# Altium schematic sheet Differential Channel Protection.SchDoc
size A4; SheetNumber: 7; SheetTotal: 11; TitleBlk1Sch: PCBA, LUCHADOR, REV 3.2b, AMBER; Eng: Haman; EngDate: 3-15-19; RevSch: 01; TitleBlk2Sch: Differential Channel Protection
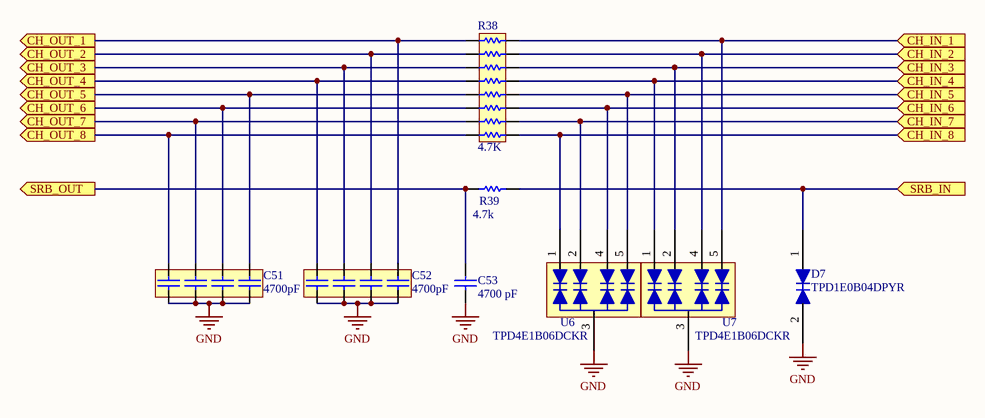
[diagram p0: Differential Channel Protection.SchDoc]

## Parts
C51  Capacitance: 4700pF  [1206C-ARRAY]  (hidden comment: 50V)
C52  Capacitance: 4700pF  [1206C-ARRAY]  (hidden comment: 50V)
C53  Capacitance: 4700 pF  [0402C]  (hidden comment: 50V)
D7  TPD1E0B04DPYR  [0402D]
R38  Resistance: 4.7K  [1506R]  (hidden comment: RES 8X)
R39  Resistance Value: 4.7k  [0402R]  (hidden comment: Res 0805)
U6  TPD4E1B06DCKR  [SC70-6]
U7  TPD4E1B06DCKR  [SC70-6]

## Ports
CH_IN_1 (in), CH_IN_2 (in), CH_IN_3 (in), CH_IN_4 (in), CH_IN_5 (in), CH_IN_6 (in), CH_IN_7 (in), CH_IN_8 (in), CH_OUT_1 (out), CH_OUT_2 (out), CH_OUT_3 (out), CH_OUT_4 (out), CH_OUT_5 (out), CH_OUT_6 (out), CH_OUT_7 (out), CH_OUT_8 (out), SRB_IN (in), SRB_OUT (out)

## Nets
GND: C51.B1 C51.B2 C51.B3 C51.B4 C52.B1 C52.B2 C52.B3 C52.B4 C53.1 D7.2(GND) U6.3(GND) U7.3(GND)
CH_IN_1: R38.B1 U7.5(IO4) ; port CH_IN_1
CH_IN_2: R38.B2 U7.4(IO3) ; port CH_IN_2
CH_IN_3: R38.B3 U7.2(IO2) ; port CH_IN_3
CH_IN_4: R38.B4 U7.1(IO1) ; port CH_IN_4
CH_IN_5: R38.B5 U6.5(IO4) ; port CH_IN_5
CH_IN_6: R38.B6 U6.4(IO3) ; port CH_IN_6
CH_IN_7: R38.B7 U6.2(IO2) ; port CH_IN_7
CH_IN_8: R38.B8 U6.1(IO1) ; port CH_IN_8
CH_OUT_1: C52.A1 R38.A1 ; port CH_OUT_1
CH_OUT_2: C52.A2 R38.A2 ; port CH_OUT_2
CH_OUT_3: C52.A3 R38.A3 ; port CH_OUT_3
CH_OUT_4: C52.A4 R38.A4 ; port CH_OUT_4
CH_OUT_5: C51.A1 R38.A5 ; port CH_OUT_5
CH_OUT_6: C51.A2 R38.A6 ; port CH_OUT_6
CH_OUT_7: C51.A3 R38.A7 ; port CH_OUT_7
CH_OUT_8: C51.A4 R38.A8 ; port CH_OUT_8
SRB_IN: D7.1(IO1) R39.2 ; port SRB_IN
SRB_OUT: C53.2 R39.1 ; port SRB_OUT

## Notes on the sheet
- Title:
- USA
- 100 Mayfield Avenue
- Mountain View, CA 94043
- Variant Name:
- Confidential and Proprietary
- Engineer:
- Date:
- Size:
- A4
- Template:
- 992-00283-00 A
- Dwg No:
- Sheet:
- Rev:
- of

## Library data of the parts
C51 C52 = Cap: CAP .1UF 50V CERAMIC Y5V 0805; Manufacturer: TDK; PCN Part Number: MLCC Part Number Change 30/Nov/2012; Manufacturer Part Number: CKCA43X7R1H472M100AA; Description1: Cap Ceramic Array 0.0047uF 50V X7R 20% 1206 SMD 4 Capacitor 125C Plastic T/R; Product Training Modules: CKC Series Array Capacitor Family; Catalog Drawings: CKC 1206 Series CKC 1206 Series Footprint; Featured Product: CKC Series; Tolerance: ±20%; Number of Capacitors: 4; Circuit Type: Isolated; Temperature Coefficient: X7R; Other Names: 445-1853-1; Revision: July-2002: Re-released for DXP Platform.; Supplier 1: Digi-Key; Supplier Part Number 1: 445-1853-1-ND; Stock 1: 155348; Pricing 1: 1=0.33, 10=0.228, 100=0.129, 500=0.0911, 1000=0.0797 (USD); RoHS Information: RoHS Certificate-MLCC; Standard Package: 1; Category: Capacitors; Family: Capacitor Arrays; Series: CKC; Packaging: Cut Tape (CT); Voltage - Rated: 50V; Dielectric Material: Ceramic; Mounting Type: Surface Mount; Package / Case: 1206 (3216 Metric); Size / Dimension: 0.126" L x 0.063" W (3.20mm x 1.60mm); Height - Seated (Max): 0.051" (1.30mm); Ratings: -; Online Catalog: CKC Series; ComponentLink1URL: https://datasheet.ciiva.com/7615/mlccspec-commercial-array-en-7615142.pdf; ComponentLink1Description: https://datasheet.ciiva.com/7615/mlccspec-commercial-array-en-7615142.pdf; ComponentLink2URL: https://datasheet.ciiva.com/7615/mlccspec-commercial-array-en-7615147.pdf; ComponentLink2Description: https://datasheet.ciiva.com/7615/mlccspec-commercial-array-en-7615147.pdf; ComponentLink3URL: https://datasheet.ciiva.com/7615/mlccspec-commercial-array-en-7615148.pdf; ComponentLink3Description: https://datasheet.ciiva.com/7615/mlccspec-commercial-array-en-7615148.pdf; ComponentLink4URL: https://datasheet.ciiva.com/24216/ckca43x7r1h472m100aa-266209-24216735.pdf; ComponentLink4Description: https://datasheet.ciiva.com/24216/ckca43x7r1h472m100aa-266209-24216735.pdf
C53 = Cap: CAP .1UF 50V CERAMIC Y5V 0805; Manufacturer: Murata; Manufacturer Part Number: GCM155R71H472KA37D; Description1: CAP CER 4700PF 50V X7R 0402; Dielectric: X7R; Tolerance (%): ±10 %; Revision: July-2002: Re-released for DXP Platform.; Supplier 1: Digi-Key; Supplier Part Number 1: 490-4915-1-ND; Stock 1: 100000; Pricing 1: 1=0.1, 10=0.047, 100=0.021, 500=0.015, 1000=0.0118, 2500=0.0107, 5000=0.0099 (USD); Case Size/Dimension: 0402; Rated Voltage: 50 V; ComponentLink1URL: https://datasheet.ciiva.com/26843/getdatasheetpartid-724237-26843665.pdf; ComponentLink1Description: https://datasheet.ciiva.com/26843/getdatasheetpartid-724237-26843665.pdf; ComponentLink2URL: https://datasheet.ciiva.com/17453/product-17453667.pdf; ComponentLink2Description: https://datasheet.ciiva.com/17453/product-17453667.pdf; ComponentLink3URL: https://datasheet.ciiva.com/2989/product-2989236.pdf; ComponentLink3Description: https://datasheet.ciiva.com/2989/product-2989236.pdf; ComponentLink4URL: https://datasheet.ciiva.com/155/product-155869.pdf; ComponentLink4Description: https://datasheet.ciiva.com/155/product-155869.pdf; ComponentLink5URL: https://datasheet.ciiva.com/16440/product-16440397.pdf; ComponentLink5Description: https://datasheet.ciiva.com/16440/product-16440397.pdf; ComponentLink6URL: https://datasheet.ciiva.com/155/product-155870.pdf; ComponentLink6Description: https://datasheet.ciiva.com/155/product-155870.pdf; ComponentLink7URL: https://datasheet.ciiva.com/155/product-155871.pdf; ComponentLink7Description: https://datasheet.ciiva.com/155/product-155871.pdf
D7 = TPD1E0B04DPYR: Manufacturer: Texas Instruments; Supplier 1: Digi-Key; Supplier Part Number 1: 296-47864-1-ND; Stock 1: 6850; Pricing 1: 1=0.43, 10=0.346, 100=0.2353, 500=0.1765, 1000=0.1324 (USD); Manufacturer Part Number: TPD1E0B04DPYR
R38 = RES 8X: Resistor; Manufacturer: Panasonic; Manufacturer Part Number: EXB-2HV472JV; Description1: Res Thick Film Array 4.7K Ohm 5% 1/4W ±200ppm/°C ISOL 16-Pin 1506(8 X 0402) Convex SMD Punched Carrier T/R; No of Elements: 8; Tolerance (%): ±5 %; Power Dissipation: 0.063 W; Voltage Rating: 50 V; Supplier 1: Digi-Key; Supplier Part Number 1: Y1472CT-ND; Stock 1: 49295; Pricing 1: 1=0.29, 10=0.248, 25=0.1804, 50=0.1308, 100=0.097, 250=0.0744, 500=0.0586, 1000=0.0406 (USD); Case Size: 0402 (1005 Metric); ComponentLink1URL: https://datasheet.ciiva.com/19466/1387876-19466987.pdf; ComponentLink1Description: https://datasheet.ciiva.com/19466/1387876-19466987.pdf; ComponentLink2URL: https://datasheet.ciiva.com/28636/1790599-28636958.pdf; ComponentLink2Description: https://datasheet.ciiva.com/28636/1790599-28636958.pdf; ComponentLink3URL: https://datasheet.ciiva.com/30089/aoc0000ce1-30089086.pdf; ComponentLink3Description: https://datasheet.ciiva.com/30089/aoc0000ce1-30089086.pdf
R39 = Res 0805: Resistor; Manufacturer: Samsung; Manufacturer Part Number: RC1005F472CS; Description1: Res Thick Film 0402 4.7K Ohm 1% 1/16W ±100ppm/C Molded SMD T/R; Tolerance: 1 %; Power Rating: 1/16 W; Case Style: Molded; Temperature Coefficient: ±100 ppm/°C; Rad Hard: No; Lead Finish: Tin; Supplier 1: Digi-Key; Supplier Part Number 1: 1276-3466-1-ND; Stock 1: 3257499; Pricing 1: 1=0.1, 10=0.021, 100=0.0087, 1000=0.0039, 2500=0.0034, 5000=0.0028 (USD); Case Size: 0402; Packaging: Tape & Reel; Type: Thick Film; Operating Temperature: -55 to 155 °C; ComponentLink1URL: https://datasheet.ciiva.com/15196/getdatasheetpartid-636616-15196228.pdf; ComponentLink1Description: https://datasheet.ciiva.com/15196/getdatasheetpartid-636616-15196228.pdf; ComponentLink2URL: https://datasheet.ciiva.com/26185/chip-resistor-150112-1-26185621.pdf; ComponentLink2Description: https://datasheet.ciiva.com/26185/chip-resistor-150112-1-26185621.pdf
U6 U7 = TPD4E1B06DCKR: Manufacturer: Texas Instruments; Description1: TVS DIODE 5.5VWM 14.5VC SC70-6; Direction Type: Uni-Directional; Maximum Clamping Voltage: 15(Typ) V; Number of Elements per Chip: 4; ESD Protection Voltage: ±18@Air Gap/±18@Contact Disc kV; Maximum Working Voltage: 5.5 V; Maximum Leakage Current: 0.01 uA; Capacitance Value: 1 pF; Supplier 1: Digi-Key; Supplier Part Number 1: 296-39346-1-ND; Stock 1: 120901; Pricing 1: 1=0.61, 10=0.519, 100=0.3876, 500=0.3046, 1000=0.2353 (USD); Type: Diode Arrays; Pin Count: 6; Minimum Operating Temperature: -40 °C; Maximum Operating Temperature: 125 °C; Mounting: Surface Mount; Category: ESD Suppressors; ComponentLink1URL: https://datasheet.ciiva.com/12545/tpd4e1b06-224687-12545147.pdf; ComponentLink1Description: https://datasheet.ciiva.com/12545/tpd4e1b06-224687-12545147.pdf; ComponentLink2URL: https://datasheet.ciiva.com/6574/tpd4e1b06-6574671.pdf; ComponentLink2Description: https://datasheet.ciiva.com/6574/tpd4e1b06-6574671.pdf; Manufacturer Part Number: TPD4E1B06DCKR